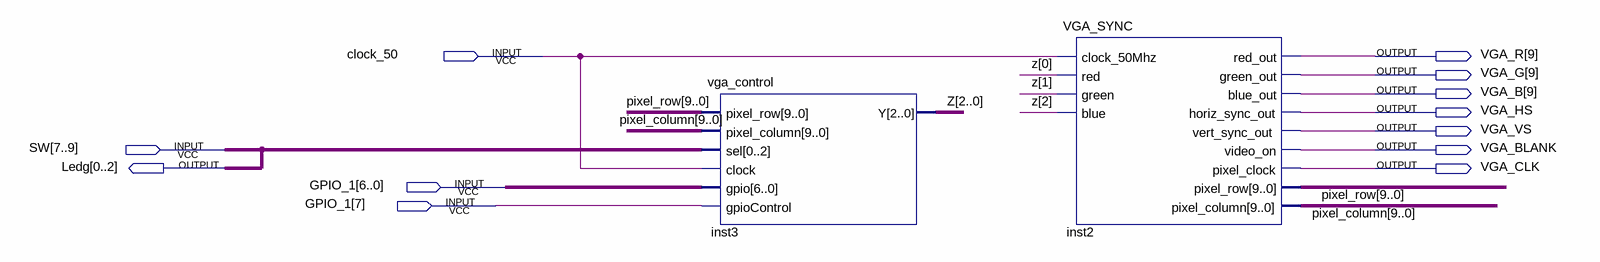
[diagram p0: schematic sheet]
// Quartus schematic Main_Project1.bdf as structural Verilog: 2 symbols, 12 pins
module Main_Project1 (
  input  clock_50,
  input  [7:9] SW,
  input  [7:0] GPIO_1,
  output [9:9] VGA_R,
  output [9:9] VGA_G,
  output [9:9] VGA_B,
  output VGA_HS,
  output VGA_VS,
  output VGA_BLANK,
  output [0:2] Ledg,
  output VGA_CLK
);

  wire [2:0] z;
  wire [9:0] pixel_column, pixel_row;

  vga_control inst3 (
    .pixel_row(pixel_row), .pixel_column(pixel_column), .sel(SW), .clock(clock_50), .gpio(GPIO_1[6:0]),
    .gpioControl(GPIO_1[7]), .Y(z));
  VGA_SYNC inst2 (
    .clock_50Mhz(clock_50), .red(z[0]), .green(z[1]), .blue(z[2]), .red_out(VGA_R[9]), .green_out(VGA_G[9]),
    .blue_out(VGA_B[9]), .horiz_sync_out(VGA_HS), .vert_sync_out(VGA_VS), .video_on(VGA_BLANK),
    .pixel_clock(VGA_CLK), .pixel_row(pixel_row), .pixel_column(pixel_column));

  assign Ledg = SW;
endmodule
